# Altium schematic sheet SCHE_balancing_robot_v2.SchDoc
size A3; SheetNumber: 1; SheetTotal: 1
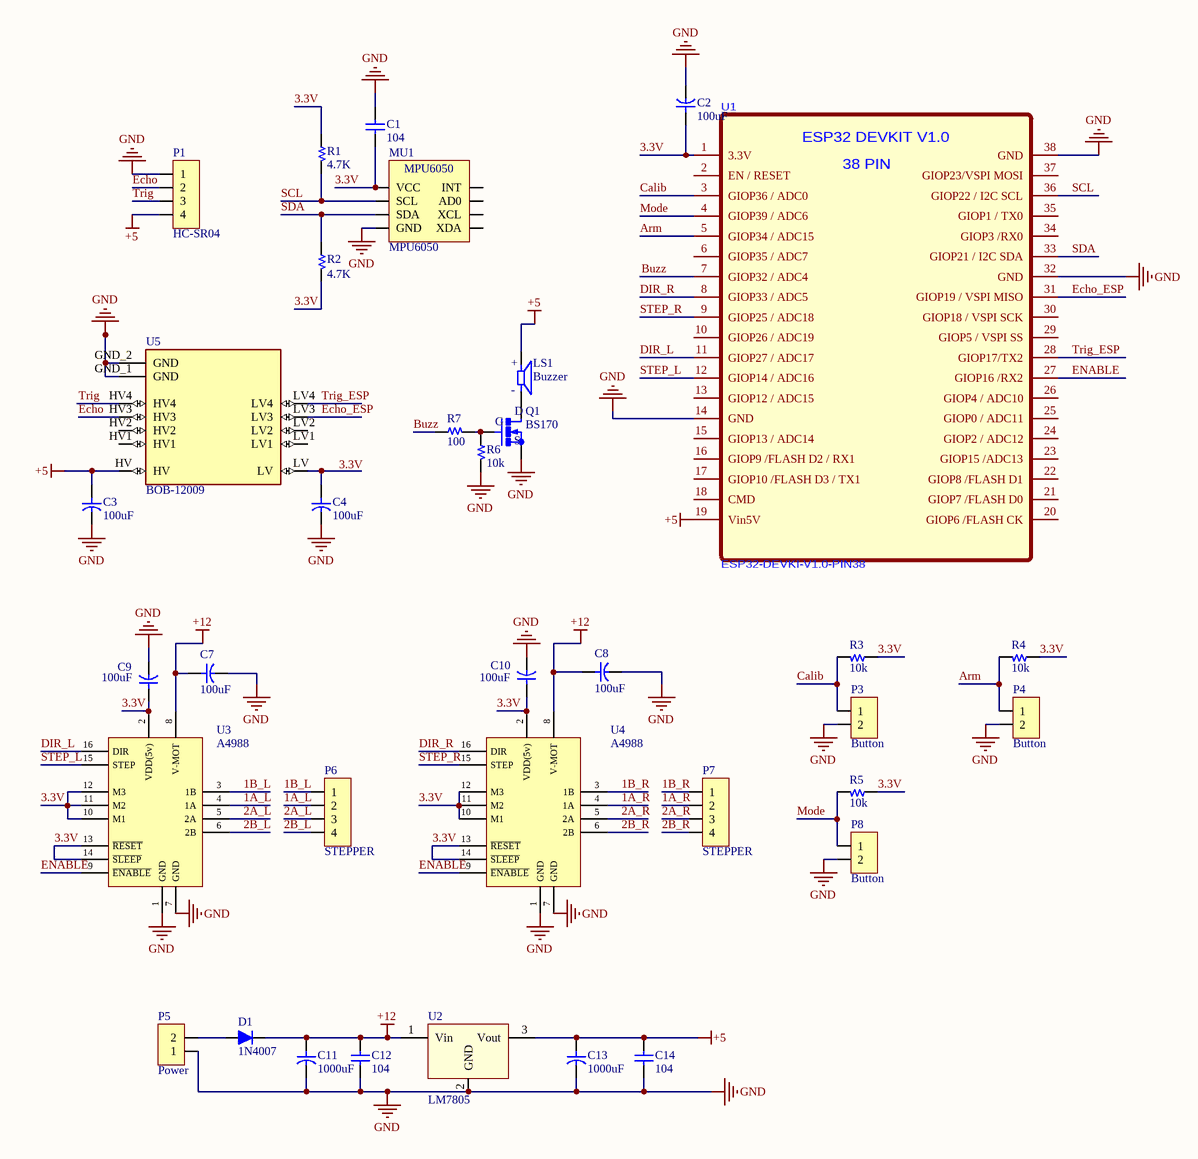
[diagram p0: SCHE_balancing_robot_v2.SchDoc]

## Parts
C1  104  [CAP Ceramic/W300]
C2  100uF  [CAP/D80/H125/LS35]
C3  100uF  [CAP/D80/H125/LS35]
C4  100uF  [CAP/D80/H125/LS35]
C7  100uF  [CAP/D80/H125/LS35]
C8  100uF  [CAP/D80/H125/LS35]
C9  100uF  [CAP/D80/H125/LS35]
C10  100uF  [CAP/D80/H125/LS35]
C11  1000uF  [CYL/D.400/LS.200]
C12  104  [CAP Ceramic/W300]
C13  1000uF  [CYL/D.400/LS.200]
C14  104  [CAP Ceramic/W300]
D1  1N4007  [DO-41]
LS1  Buzzer  [Buzzer-12MM]
MU1  MPU6050  [MPU6050]
P1  HC-SR04  [HDR/Header/4/BOX]
P3  Button  [HDR/Terminal/2/5mm]
P4  Button  [HDR/Terminal/2/5mm]
P5  Power  [HDR/Terminal/2/5mm]
P6  STEPPER  [HDR/Header/4/BOX]
P7  STEPPER  [HDR/Header/4/BOX]
P8  Button  [HDR/Terminal/2/5mm]
Q1  BS170  [TO92]
R1  4.7K  [R 1/4W/300]
R2  4.7K  [R 1/4W/300]
R3  10k  [R 1/4W/300]
R4  10k  [R 1/4W/300]
R5  10k  [R 1/4W/300]
R6  10k  [R 1/4W/300]
R7  100  [R 1/4W/300]
U1  ESP32-DEVKI-V1.0-PIN38  [ESP32-DEVKIT-V1.0-38PIN]
U2  LM7805  [TO-220]
U3  A4988  [A4988(driver)]
U4  A4988  [A4988(driver)]
U5  BOB-12009  [CONV_BOB-12009]

## Nets
+5: C3.1 C13.1 C14.1 LS1.1(P) P1.4 U1.19(Vin5V) U2.3(Vout) U5.HV
+12: C7.1 C8.1 C11.1 C12.1 D1.2(K) U2.1(Vin) U3.8(V-MOT) U4.8(V-MOT)
GND: C1.1 C2.2 C3.2 C4.2 C7.2 C8.2 C9.2 C10.2 C11.2 C12.2 C13.2 C14.2 MU1.2(GND) P1.1 P3.2 P4.2 P5.1 P8.2 Q1.3(S) R6.2 U1.14(GND) U1.32(GND) U1.38(GND) U2.2(GND) U3.1(GND) U3.7(GND) U4.1(GND) U4.7(GND) U5.GND_1(GND) U5.GND_2(GND)
1A_L: P6.2 U3.4(1A)
1A_R: P7.2 U4.4(1A)
1B_L: P6.1 U3.3(1B)
1B_R: P7.1 U4.3(1B)
2A_L: P6.3 U3.5(2A)
2A_R: P7.3 U4.5(2A)
2B_L: P6.4 U3.6(2B)
2B_R: P7.4 U4.6(2B)
3.3V: C1.2 C2.1 C9.1 C10.1 MU1.1(VCC) R1.1 R2.2 R3.1 R4.1 R5.1 U1.1(3.3V) U3.2(VDD(5v)) U3.10(M1) U3.11(M2) U3.12(M3) U3.13(~{RESET}) U3.14(~{SLEEP}) U4.2(VDD(5v)) U4.10(M1) U4.11(M2) U4.12(M3) U4.13(~{RESET}) U4.14(~{SLEEP})
Arm: P4.1 R4.2 U1.5(GIOP34_/_ADC15)
Buzz: R7.1 U1.7(GIOP32_/_ADC4)
Calib: P3.1 R3.2 U1.3(GIOP36_/_ADC0)
DIR_L: U1.11(GIOP27_/_ADC17) U3.16(DIR)
DIR_R: U1.8(GIOP33_/_ADC5) U4.16(DIR)
Echo: P1.2 U5.HV3
Echo_ESP: U1.31(GIOP19_/_VSPI_MISO) U5.LV3
ENABLE: U1.27(GIOP16_/RX2) U3.9(~{ENABLE}) U4.9(~{ENABLE})
Mode: P8.1 R5.2 U1.4(GIOP39_/_ADC6)
SCL: MU1.3(SCL) R1.2 U1.36(GIOP22_/_I2C_SCL)
SDA: MU1.4(SDA) R2.1 U1.33(GIOP21_/_I2C_SDA)
STEP_L: U1.12(GIOP14_/_ADC16) U3.15(STEP)
STEP_R: U1.9(GIOP25_/_ADC18) U4.15(STEP)
Trig: P1.3 U5.HV4
Trig_ESP: U1.28(GIOP17/TX2) U5.LV4
NetC4_1: C4.1 U5.LV
NetD1_1: D1.1(A) P5.2
NetLS1_2: LS1.2(M) Q1.1(D)
NetQ1_2: Q1.2(G) R6.1 R7.2

Not connected (* = marked no-connect by the designer): MU1 5(XDA) 6(XCL) 7(AD0) 8(INT); U1 2(EN_/_RESET) 6(GIOP35_/_ADC7) 10(GIOP26_/_ADC19) 13(GIOP12_/_ADC15) 15(GIOP13_/_ADC14) 16(GIOP9_/FLASH_D2_/_RX1) 17(GIOP10_/FLASH_D3_/_TX1) 18(CMD) 20(GIOP6_/FLASH_CK) 21(GIOP7_/FLASH_D0) 22(GIOP8_/FLASH_D1) 23(GIOP15_/ADC13) 24(GIOP2_/_ADC12) 25(GIOP0_/_ADC11) 26(GIOP4_/_ADC10) 29(GIOP5_/_VSPI_SS) 30(GIOP18_/_VSPI_SCK) 34(GIOP3_/RX0) 35(GIOP1_/_TX0) 37(GIOP23/VSPI_MOSI); U5 HV1 HV2 LV1 LV2

## Notes on the sheet
- Labels drawn without touching a wire or pin: 3.3V
- (in symbol Buzzer) +; -
- (in symbol ESP32-DEVKI-V1.0-PIN38) ESP32 DEVKIT V1.0; 38 PIN

## Library data of the parts
C1 C12 C14 = Capacitor NP: Capacitor non-pol
C2-C4 C7-C11 C13 = Capacitor: Capacitor pol
D1 = Diode: Default Diode
LS1 = Buzzer: MP: CST-951AP; Availability: Unavailable; Price: None; Value: *; Package: None
MU1 = MPU6050: Manufacturer: W¨¹rth Elektronik eiSos GmbH; partNo: 613004143121; ComponentLink1 Description: Manufacturer; ComponentLink2 Description: Datasheet; NoPins: 04; Created Date: 29 March 2013; ComponentLink1URL: http://www.we-online.com; ComponentLink2URL: http://katalog.we-online.de/em/datasheet/6130xx143121.pdf; Created by: Karrer Zheng
P1 P6 P7 = Header 4: Header, 4-Pin
P3-P5 P8 = Header 2: Header, 2-Pin
Q1 = BS170: Nì±„ë„ 60V 500mA(Ta) 830mW(Ta) ê´€í†µí™€ TO-92-3; MF: onsemi; SnapEDA_Link: https://www.snapeda.com/parts/BS170/Onsemi/view-part/?ref=snap; Package: TO-92-3 ON Semiconductor; Value: *; MP: BS170; Check_prices: https://www.snapeda.com/parts/BS170/Onsemi/view-part/?ref=eda
R1-R7 = Resistor
U2 = 78xx: LDO Fixed Voltage regulator
U5 = BOB-12009: BSS138 - Logic-Level Translator Interface Evaluation Board; MF: SparkFun; SnapEDA_Link: https://www.snapeda.com/parts/BOB-12009/SparkFun/view-part/?ref=snap; Package: None; Value: *; MP: BOB-12009; Check_prices: https://www.snapeda.com/parts/BOB-12009/SparkFun/view-part/?ref=eda